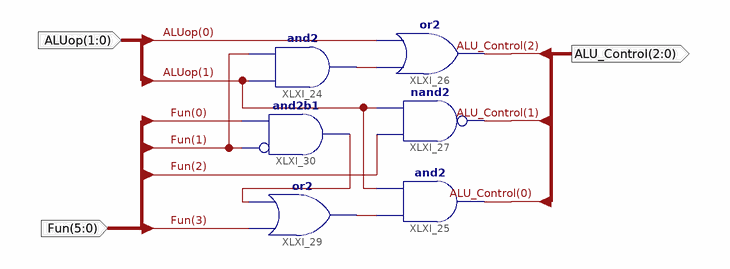
[diagram p0: schematic sheet 1]
// Xilinx ISE schematic ALU_Decoder.sch (kintex7) as structural Verilog: 6 symbols, 3 ports
module ALU_Decoder (
  input  [5:0] Fun,
  input  [1:0] ALUop,
  output [2:0] ALU_Control
);

  wire XLXN_255, XLXN_266, XLXN_372;

  and XLXI_25 (ALU_Control[0], XLXN_266, ALUop[1]);
  nand XLXI_27 (ALU_Control[1], Fun[2], ALUop[1]);
  and XLXI_24 (XLXN_255, ALUop[1], Fun[1]);
  or XLXI_26 (ALU_Control[2], XLXN_255, ALUop[0]);
  and XLXI_30 (XLXN_372, ~Fun[1], Fun[0]);  // and2b1
  or XLXI_29 (XLXN_266, Fun[3], XLXN_372);
endmodule
